# Altium schematic sheet 03-FT601.SchDoc
size B; SheetNumber: 3; SheetTotal: 14
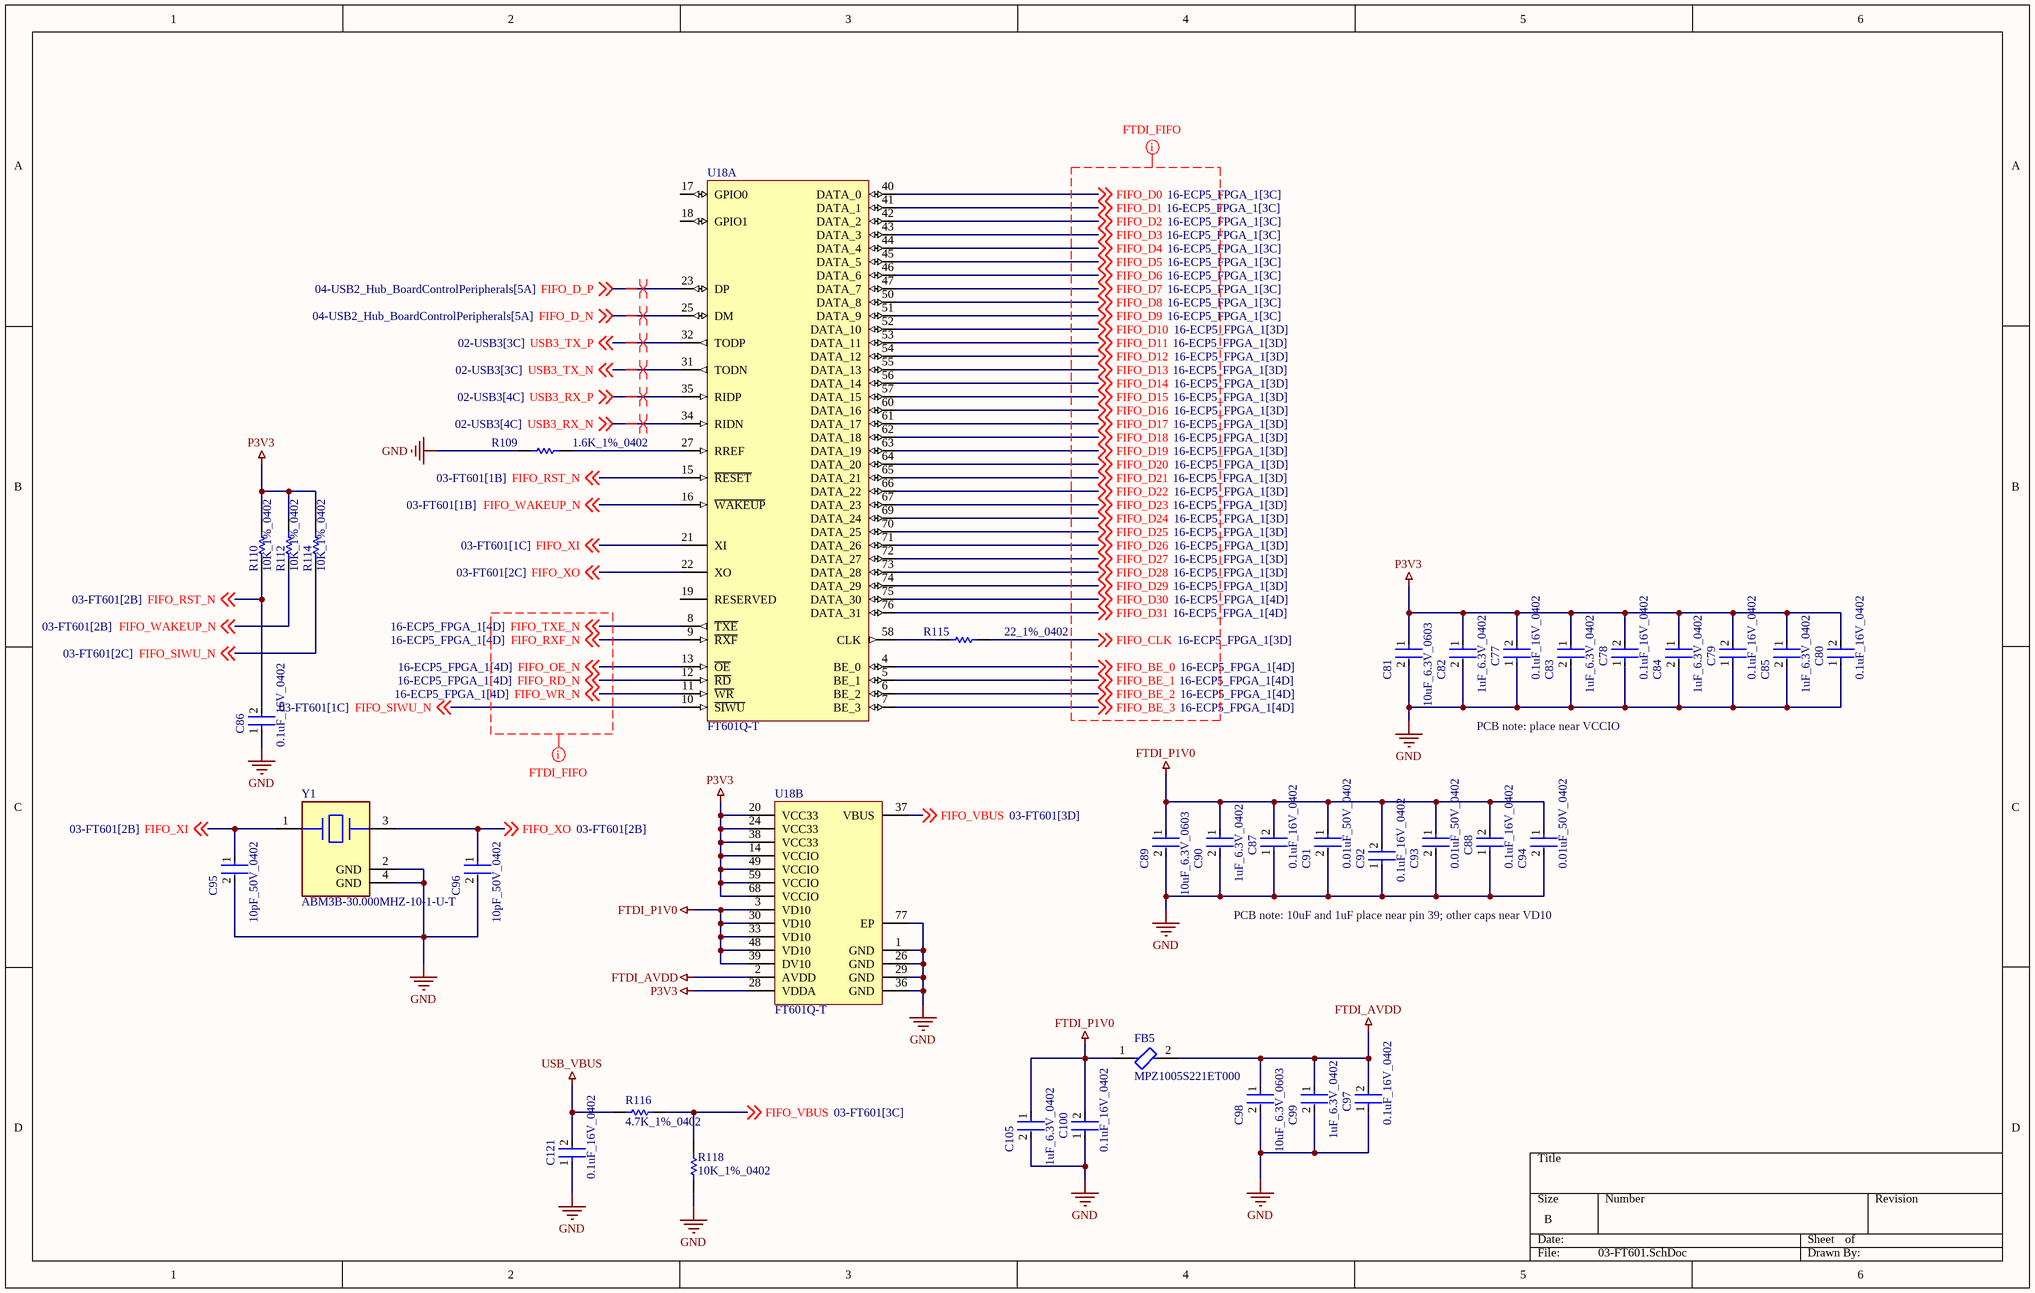
[diagram p0: 03-FT601.SchDoc]

## Parts
C77  0.1uF_16V_0402  [FP-C0402-BB-MFG]
C78  0.1uF_16V_0402  [FP-C0402-BB-MFG]
C79  0.1uF_16V_0402  [FP-C0402-BB-MFG]
C80  0.1uF_16V_0402  [FP-C0402-BB-MFG]
C81  10uF_6.3V_0603  [FP-GRM188-0_1-e0_2_0_55-IPC_A]
C82  1uF_6.3V_0402  [FP-CC0402-MFG]
C83  1uF_6.3V_0402  [FP-CC0402-MFG]
C84  1uF_6.3V_0402  [FP-CC0402-MFG]
C85  1uF_6.3V_0402  [FP-CC0402-MFG]
C86  0.1uF_16V_0402  [FP-C0402-BB-MFG]
C87  0.1uF_16V_0402  [FP-C0402-BB-MFG]
C88  0.1uF_16V_0402  [FP-C0402-BB-MFG]
C89  10uF_6.3V_0603  [FP-GRM188-0_1-e0_2_0_55-IPC_A]
C90  1uF_6.3V_0402  [FP-CC0402-MFG]
C91  0.01uF_50V_0402  [FP-C0402-BB-MFG]
C92  0.1uF_16V_0402  [FP-C0402-BB-MFG]
C93  0.01uF_50V_0402  [FP-C0402-BB-MFG]
C94  0.01uF_50V_0402  [FP-C0402-BB-MFG]
C95  10pF_50V_0402  [FP-C0402-BB-MFG]
C96  10pF_50V_0402  [FP-C0402-BB-MFG]
C97  0.1uF_16V_0402  [FP-C0402-BB-MFG]
C98  10uF_6.3V_0603  [FP-GRM188-0_1-e0_2_0_55-IPC_A]
C99  1uF_6.3V_0402  [FP-CC0402-MFG]
C100  0.1uF_16V_0402  [FP-C0402-BB-MFG]
C105  1uF_6.3V_0402  [FP-CC0402-MFG]
C121  0.1uF_16V_0402  [FP-C0402-BB-MFG]
FB5  MPZ1005S221ET000  [FP-MPZ1005-IPC_A]
R109  1.6K_1%_0402  [RESC1005X40X25LL05T05]
R110  10K_1%_0402  [RESC1005X40X25NL10T10]
R112  10K_1%_0402  [RESC1005X40X25NL10T10]
R114  10K_1%_0402  [RESC1005X40X25NL10T10]
R115  22_1%_0402  [RESC1005X40X25ML05T05]
R116  4.7K_1%_0402  [RESC1005X40X25NL05T10]
R118  10K_1%_0402  [RESC1005X40X25NL10T10]
U18  FT601Q-T  [FTDI-QFN-76_M]  (parts A,B of 2)
Y1  ABM3B-30.000MHZ-10-1-U-T  [FP-ABM3B-MFG]

## Nets
FTDI_AVDD: C97.2 C98.1 C99.1 FB5.2 U18.2(AVDD)
FTDI_P1V0: C87.2 C88.2 C89.1 C90.1 C91.1 C92.2 C93.1 C94.1 C100.2 C105.1 FB5.1 U18.3(VD10) U18.30(VD10) U18.33(VD10) U18.39(DV10) U18.48(VD10)
GND: C77.1 C78.1 C79.1 C80.1 C81.2 C82.2 C83.2 C84.2 C85.2 C86.1 C87.1 C88.1 C89.2 C90.2 C91.2 C92.1 C93.2 C94.2 C95.2 C96.2 C97.1 C98.2 C99.2 C100.1 C105.2 C121.1 R109.1 R118.2 U18.1(GND) U18.26(GND) U18.29(GND) U18.36(GND) U18.77(EP) Y1.2(GND) Y1.4(GND)
P3V3: C77.2 C78.2 C79.2 C80.2 C81.1 C82.1 C83.1 C84.1 C85.1 R110.1 R112.1 R114.1 U18.14(VCCIO) U18.20(VCC33) U18.24(VCC33) U18.28(VDDA) U18.38(VCC33) U18.49(VCCIO) U18.59(VCCIO) U18.68(VCCIO)
USB_VBUS: C121.2 R116.1
FIFO_BE_0: U18.4(BE_0) ; off-sheet FIFO_BE_0
FIFO_BE_1: U18.5(BE_1) ; off-sheet FIFO_BE_1
FIFO_BE_2: U18.6(BE_2) ; off-sheet FIFO_BE_2
FIFO_BE_3: U18.7(BE_3) ; off-sheet FIFO_BE_3
FIFO_CLK: R115.2 ; off-sheet FIFO_CLK
FIFO_D0: U18.40(DATA_0) ; off-sheet FIFO_D0
FIFO_D1: U18.41(DATA_1) ; off-sheet FIFO_D1
FIFO_D2: U18.42(DATA_2) ; off-sheet FIFO_D2
FIFO_D3: U18.43(DATA_3) ; off-sheet FIFO_D3
FIFO_D4: U18.44(DATA_4) ; off-sheet FIFO_D4
FIFO_D5: U18.45(DATA_5) ; off-sheet FIFO_D5
FIFO_D6: U18.46(DATA_6) ; off-sheet FIFO_D6
FIFO_D7: U18.47(DATA_7) ; off-sheet FIFO_D7
FIFO_D8: U18.50(DATA_8) ; off-sheet FIFO_D8
FIFO_D9: U18.51(DATA_9) ; off-sheet FIFO_D9
FIFO_D10: U18.52(DATA_10) ; off-sheet FIFO_D10
FIFO_D11: U18.53(DATA_11) ; off-sheet FIFO_D11
FIFO_D12: U18.54(DATA_12) ; off-sheet FIFO_D12
FIFO_D13: U18.55(DATA_13) ; off-sheet FIFO_D13
FIFO_D14: U18.56(DATA_14) ; off-sheet FIFO_D14
FIFO_D15: U18.57(DATA_15) ; off-sheet FIFO_D15
FIFO_D16: U18.60(DATA_16) ; off-sheet FIFO_D16
FIFO_D17: U18.61(DATA_17) ; off-sheet FIFO_D17
FIFO_D18: U18.62(DATA_18) ; off-sheet FIFO_D18
FIFO_D19: U18.63(DATA_19) ; off-sheet FIFO_D19
FIFO_D20: U18.64(DATA_20) ; off-sheet FIFO_D20
FIFO_D21: U18.65(DATA_21) ; off-sheet FIFO_D21
FIFO_D22: U18.66(DATA_22) ; off-sheet FIFO_D22
FIFO_D23: U18.67(DATA_23) ; off-sheet FIFO_D23
FIFO_D24: U18.69(DATA_24) ; off-sheet FIFO_D24
FIFO_D25: U18.70(DATA_25) ; off-sheet FIFO_D25
FIFO_D26: U18.71(DATA_26) ; off-sheet FIFO_D26
FIFO_D27: U18.72(DATA_27) ; off-sheet FIFO_D27
FIFO_D28: U18.73(DATA_28) ; off-sheet FIFO_D28
FIFO_D29: U18.74(DATA_29) ; off-sheet FIFO_D29
FIFO_D30: U18.75(DATA_30) ; off-sheet FIFO_D30
FIFO_D31: U18.76(DATA_31) ; off-sheet FIFO_D31
FIFO_D_N: U18.25(DM) ; off-sheet FIFO_D_N
FIFO_D_P: U18.23(DP) ; off-sheet FIFO_D_P
FIFO_OE_N: U18.13(~{OE}) ; off-sheet FIFO_OE_N
FIFO_RD_N: U18.12(~{RD}) ; off-sheet FIFO_RD_N
FIFO_RST_N: C86.2 R110.2 U18.15(~{RESET}) ; off-sheet FIFO_RST_N
FIFO_RXF_N: U18.9(~{RXF}) ; off-sheet FIFO_RXF_N
FIFO_SIWU_N: R114.2 U18.10(~{SIWU}) ; off-sheet FIFO_SIWU_N
FIFO_TXE_N: U18.8(~{TXE}) ; off-sheet FIFO_TXE_N
FIFO_VBUS: R116.2 R118.1 U18.37(VBUS) ; off-sheet FIFO_VBUS
FIFO_WAKEUP_N: R112.2 U18.16(~{WAKEUP}) ; off-sheet FIFO_WAKEUP_N
FIFO_WR_N: U18.11(~{WR}) ; off-sheet FIFO_WR_N
FIFO_XI: C95.1 U18.21(XI) Y1.1 ; off-sheet FIFO_XI
FIFO_XO: C96.1 U18.22(XO) Y1.3 ; off-sheet FIFO_XO
USB3_RX_N: U18.34(RIDN) ; off-sheet USB3_RX_N
USB3_RX_P: U18.35(RIDP) ; off-sheet USB3_RX_P
USB3_TX_N: U18.31(TODN) ; off-sheet USB3_TX_N
USB3_TX_P: U18.32(TODP) ; off-sheet USB3_TX_P
NetR109_2: R109.2 U18.27(RREF)
NetR115_1: R115.1 U18.58(CLK)

Not connected (* = marked no-connect by the designer): U18 17(GPIO0) 18(GPIO1) 19(RESERVED)

## Layout directives
mark named FTDI_FIFO: FIFO_BE_0, FIFO_BE_1, FIFO_BE_2, FIFO_BE_3, FIFO_CLK, FIFO_D0, FIFO_D1, FIFO_D2, FIFO_D3, FIFO_D4, FIFO_D5, FIFO_D6, FIFO_D7, FIFO_D8, FIFO_D9, FIFO_D10, FIFO_D11, FIFO_D12, FIFO_D13, FIFO_D14, FIFO_D15, FIFO_D16, FIFO_D17, FIFO_D18, FIFO_D19, FIFO_D20, FIFO_D21, FIFO_D22, FIFO_D23, FIFO_D24, FIFO_D25, FIFO_D26, FIFO_D27, FIFO_D28, FIFO_D29, FIFO_D30, FIFO_D31, FIFO_OE_N, FIFO_RD_N, FIFO_RXF_N, FIFO_TXE_N, FIFO_WR_N
differential pair: FIFO_D_N, FIFO_D_P, USB3_RX_N, USB3_RX_P, USB3_TX_N, USB3_TX_P

## Notes on the sheet
- PCB note: place near VCCIO
- PCB note: 10uF and 1uF place near pin 39; other caps near VD10

## Library data of the parts
C77-C80 C86-C88 C92 C97 C100 C121 = CMP-1034-02068-3: CAP CER 0.1UF 16V 5% X7R 0402; Manufacturer: Kemet; Manufacturer Part Number: C0402C104J4RACTU; Value: 0.10 μF; Temperature Coefficient: 15%; Tolerance: 0.05; Material: Ceramic; ComponentLink2URL: https://content.kemet.com/datasheets/KEM_C1002_X7R_SMD.pdf; Automotive: No; Device Class L2: Capacitors; Temperature: -55°C to +125°C; RoHS: TRUE; Voltage Rating: 16 V; ComponentLink2Description: Datasheet; Device Class L3: Ceramic Capacitors; Temperature Range Low: -55°C; Ipc Land Pattern Name: CAPC10050X50; Device Class L1: Passive Components; Temperature Range High: +125°C; Package: C0402-BB; Capacitance: 0.10 μF; Category: Cap; Mouser Description: CAP CER 0.1UF 16V X7R 0402; Height: 0.55mm; Digikey Description: CAP CER 0.1UF 16V 5% X7R 0402; Octopart: https://octopart.com/c0402c104j4ractu-kemet-12573893; Temperature Characteristic: X7R; Lead Free: Yes
C81 C89 C98 = CMP-2006-02792-2: Chip Multilayer Ceramic Capacitors for General Purpose, 0603, 10uF, X5R, 15%, 20%, 6.3V; Packaging: Tape and Reel; Voltage Rating (DC): 6.3V; Width: 0.031inch; Termination: SMD/SMT; Dielectric: X5R; Package Quantity: 4000; Voltage Rating: 6.3V; Capacitance: 10uF; Case/Package: 0603; Min Operating Temperature: -55°C; Voltage: 6.3V; Length: 1.6mm; Thickness: 0.035inch; Lead Free: Lead Free; Depth: 0.8mm; Case Code (Imperial): 0603; Max Operating Temperature: 85°C; Material: Ceramic; Height: 0.8mm; Tolerance: 20%; Mount: Surface Mount; REACH SVHC: No SVHC; Radiation Hardening: No; Case Code (Metric): 1608
C82-C85 C90 C99 C105 = CMP-2100-03591-2: CAP CER 1UF 6.3V X5R 0402; Manufacturer: YAGEO; Manufacturer Part Number: CC0402KRX5R5BB105; Automotive Grade: NA; Material: Ceramic; Tolerance: 0.1; Temperature Coefficient: 30ppm/°C; Voltage Rating: 6.3 V; Temperature Range Low: -55°C; Digikey Description: CAP CER 1UF 6.3V X5R 0402; Capacitance: 1 uF; Height: 0.55mm; Automotive: No; ComponentLink2URL: http://www.yageo.com/documents/recent/UPY-GP_NP0_16V-to-50V_16.pdf; Device Class L2: Capacitors; RoHS: TRUE; Temperature Range High: +125°C; Device Class L3: Ceramic Capacitors; Device Class L1: Passive Components; Temperature Characteristic: X5R; Package: CC0402; Octopart: https://octopart.com/cc0402krx5r5bb105-yageo-42244618; ComponentLink2Description: Datasheet; Temperature: -55°C to +125°C; Mouser Description: Multilayer Ceramic Capacitors MLCC - SMD/SMT 1uF 6.3V X5R 10%; Category: Cap; Footprint Url: http://www.yageo.com/exep/pages/download/literatures/UPY-C_GEN_24.pdf; Lead Free: Yes; Ipc Land Pattern Name: CAPC10050X50; Value: 1 uF
C91 C93 C94 = CMP-2008-02109-2: CAP CER 10000PF 50V X7R 0402; Manufacturer: Kemet; Manufacturer Part Number: C0402C103K5RACTU; Temperature Coefficient: 15%; Tolerance: 0.1; Value: 10,000 pF; Material: Ceramic; Device Class L3: Ceramic Capacitors; Digikey Description: CAP CER 10000PF 50V X7R 0402; Height: 0.55mm; Temperature Range Low: -55°C; Package: C0402-BB; ComponentLink2URL: https://content.kemet.com/datasheets/KEM_C1002_X7R_SMD.pdf; Lead Free: Yes; Mouser Description: Capacitor; Ceramic; Cap; .010uF; Tol 10%; SMT; Vol-Rtg 50V; X7R; Tape and Reel; Ipc Land Pattern Name: CAPC10050X50; Temperature Range High: +125°C; Device Class L1: Passive Components; Category: Cap; Octopart: https://octopart.com/c0402c103k5ractu-kemet-95985; Temperature Characteristic: X7R; Automotive: No; Device Class L2: Capacitors; ComponentLink2Description: Datasheet; Voltage Rating: 50 V; Capacitance: 10,000 pF; RoHS: TRUE; Temperature: -55°C to +125°C
C95 C96 = CMP-2008-03404-2: Multilayer Ceramic Capacitor, C Series, 10 Pf, - 5%, C0G / Np0, 50 V, 0402 [1005 Metric] Rohs Compliant: Yes; Manufacturer Part Number: C0402C100J5GACTU; Manufacturer: Kemet; Temperature Coefficient: 15%; Voltage Rating: 50 V; Capacitance: 10 pF; Value: 10 pF; Tolerance: 0.05; Automotive: No; Temperature Range High: +125°C; ComponentLink2Description: Datasheet; Material: Ceramic; Lead Free: Yes; ComponentLink2URL: https://content.kemet.com/datasheets/KEM_C1002_X7R_SMD.pdf; Device Class L3: Ceramic Capacitors; RoHS: TRUE; Package: C0402-BB; Temperature: -55°C to +125°C; Temperature Range Low: -55°C; Height: 0.55mm; Mouser Description: Multilayer Ceramic Capacitor, C Series, 10 Pf, - 5%, C0G / Np0, 50 V, 0402 [1005 Metric] Rohs Compliant: Yes; Octopart: https://octopart.com/c0402c100j5gactu-kemet-108448; Digikey Description: Multilayer Ceramic Capacitor, C Series, 10 Pf, - 5%, C0G / Np0, 50 V, 0402 [1005 Metric] Rohs Compliant: Yes; Temperature Characteristic: C0G; Category: Cap; Ipc Land Pattern Name: CAPC10050X50; Device Class L1: Passive Components; Device Class L2: Capacitors
FB5 = CMP-08257-000226-1: Power line Ferrite Bead 220Ω @ 100MHz 0.9A DCR 0.22Ω SMD 0402; Max Current Rating: 900mA; Impedance: 220R; Number of Lines: 1; DC Resistance (DCR): 220mR; Tolerance: 25%; Mount: Surface Mount; Case Code (Metric): 1005; Height: 0.022inch; Min Operating Temperature: -55°C; Max Operating Temperature: 125°C; RoHS Compliant: Yes; Length: 0.039inch; Width: 0.02inch; Case Code (Imperial): 0402; Case/Package: 0402; Package Quantity: 10000; Max DC Current: 900mA; Core Material: Ferrite; Packaging: Tape and Reel
R109 = CMP-2002-00708-1: Manufacturer: Panasonic; Part Number: ERJ-2RKF1601X
R110 R112 R114 R118 = CMP-2002-04694-1: Manufacturer: Bourns; Part Number: CR0402-FX-1002GLF
R115 = CMP-2002-01135-4: Chip Resistor, 22 Ohm, +/- 1%, 0.1 W, -55 to 155 degC, 0402 (1005 Metric), RoHS, Tape and Reel; PartNumber: ERJ-2RKF22R0X; Case\/Package: 0402; Resistance: 22 Ohm; Power Rating: 100 mW; Voltage Rating: 50 V; ComponentLink2Description: Datasheet; Packaging: Tape and Reel; Weight: 2.8E-05oz; Pins: 2; Case Code (Imperial): 0402; Width: 0.5 mm; ComponentLink2URL: http://industrial.panasonic.com/cdbs/www-data/pdf/RDA0000/AOA0000C86.pdf; Height: 0.35 mm; PackageReference: 0402; REACH SVHC: Yes; Min Operating Temperature: -55 degC; Length: 1 mm; DatasheetVersion: 04/2015; RoHSCompliant: true; Package Quantity: 10000; Case Code (Metric): 1005; PackageDescription: 2-Pin Surface Mount Device, Body 1 x 0.5 mm; ComponentLink1URL: http://www.panasonic.com/; Mount: Surface Mount; Mounting Technology: Surface Mount; Tolerance: 1%; Max Operating Temperature: 155 degC; ComponentLink1Description: Manufacturer URL
R116 = CMP-1011-00586-2: Manufacturer: Yageo / Phycomp; Part Number: RC0402FR-074K7L
U18 = CMP-1736-00001-1: 32 Bit USB 3.0 to FIFO Bridge, 5 Gbps, 3 to 3.6 V, -40 to 85 degC, 76-Pin QFN, Pb-Free, Tray; ComponentLink2Description: Datasheet; Mounting Technology: Surface Mount; ComponentLink1Description: Manufacturer URL; Case/Package: QFN; RoHSCompliant: false; PackageDescription: 76-Pin Quad Flat No-lead Package, Body 9 x 9 mm, Pitch 0.4 mm, Thermal Pad 5.45 x 5.45 mm; ComponentLink2URL: http://www.ftdichip.com/Support/Documents/DataSheets/ICs/DS_FT600Q-FT601Q%20IC%20Datasheet.pdf; DatasheetVersion: Rev. 1.02, 02/2016; PartNumber: FT601Q-T; ComponentLink1URL: http://www.ftdichip.com/
Y1 = CMP-27762-014122-1: Crystal 30MHz ±10ppm 10pF SMD-4 5mm x 3.2mm; ESR (Equivalent Series Resistance): 50R; Packaging: Tape and Reel; Series: ABM3B; Resistor Type: Ceramic; Tolerance: 10ppm; Radiation Hardening: No; Mount: Surface Mount; Max Operating Temperature: 60°C; Operating Frequency: 30 MHz; Min Operating Temperature: -10°C; Length: 5mm; Height: 0.043inch; Frequency: 30MHz; Number of Pins: 4; Frequency Stability: 10ppm; Frequency Tolerance: 10ppm; Case/Package: CSMD; Lead Free: Lead Free; Depth: 3.2mm; Termination: SMD/SMT; Load Capacitance: 10pF; Package Quantity: 1000; Width: 0.126inch